# EAGLE schematic suitcase_main_board (EAGLE 8.2.0)
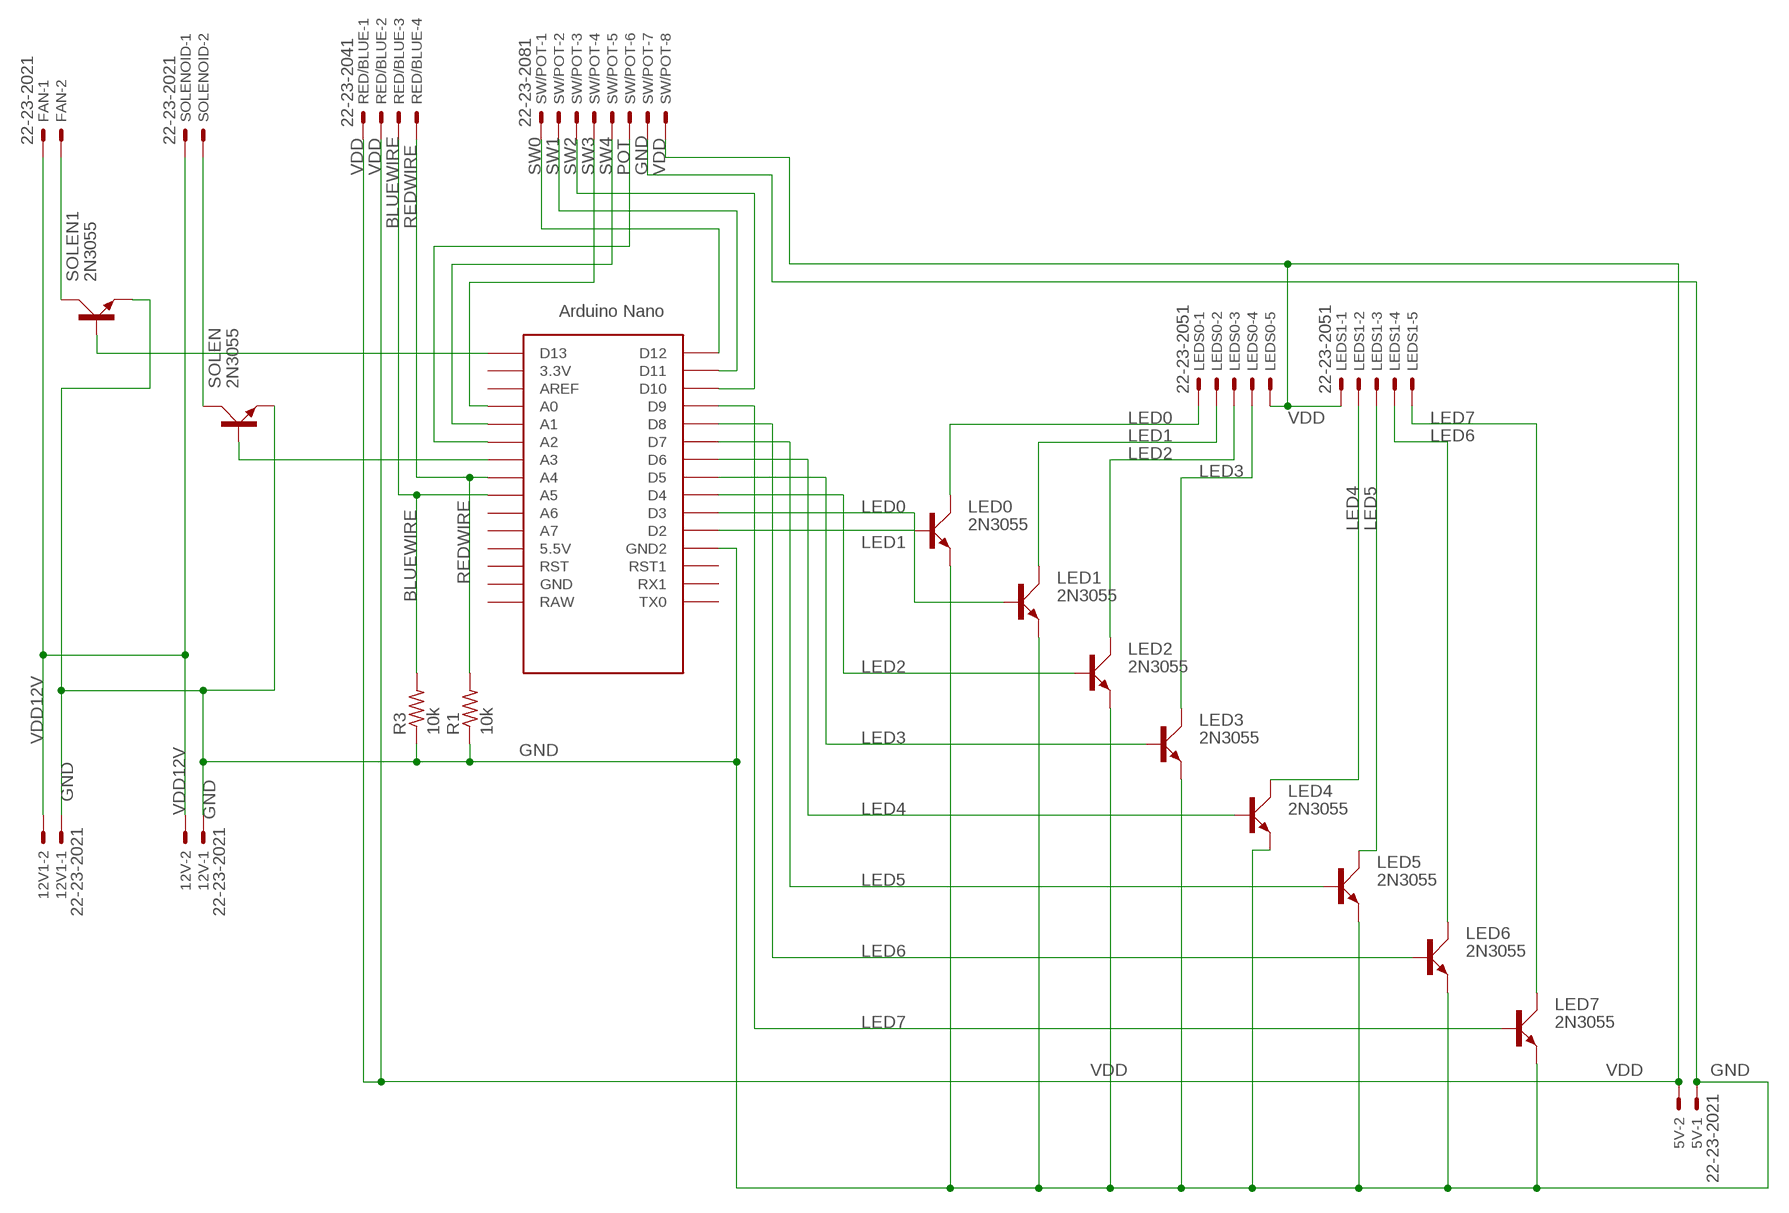
[diagram p0: schematic, sheet 1]

## Parts
5V  22-23-2021  [22-23-2021]
12V  22-23-2021  [22-23-2021]
12V1  22-23-2021  [22-23-2021]
FAN  22-23-2021  [22-23-2021]
LED0  2N3055  [TO3A]
LED1  2N3055  [TO3A]
LED2  2N3055  [TO3A]
LED3  2N3055  [TO3A]
LED4  2N3055  [TO3A]
LED5  2N3055  [TO3A]
LED6  2N3055  [TO3A]
LED7  2N3055  [TO3A]
LEDS0  22-23-2051  [22-23-2051]
LEDS1  22-23-2051  [22-23-2051]
R1  10k  R-US_0207/12  [0207/12]
R3  10k  R-US_0207/12  [0207/12]
RED/BLUE  22-23-2041  [22-23-2041]
SOLEN  2N3055  [TO3A]
SOLEN1  2N3055  [TO3A]
SOLENOID  22-23-2021  [22-23-2021]
SW/POT  22-23-2081  [22-23-2081]
U$1  NANO  [NANO]

## Nets
BLUEWIRE: R3.2 RED/BLUE.3 U$1.A5
GND: 5V.1 12V1.1 12V.1 LED0.E LED1.E LED2.E LED3.E LED4.E LED5.E LED6.E LED7.E R1.1 R3.1 SOLEN1.E SOLEN.E SW/POT.7 U$1.GND1(GND2)
LED0: LED0.C LED0.C1(C) LED1.B LEDS0.1 U$1.D3
LED1: LED0.B LED1.C LED1.C1(C) LEDS0.2 U$1.D2
LED2: LED2.B LED2.C LED2.C1(C) LEDS0.3 U$1.D4
LED3: LED3.B LED3.C LED3.C1(C) LEDS0.4 U$1.D5
LED4: LED4.B LED4.C LED4.C1(C) LEDS1.2 U$1.D6
LED5: LED5.B LED5.C LED5.C1(C) LEDS1.3 U$1.D7
LED6: LED6.B LED6.C LED6.C1(C) LEDS1.4 U$1.D8
LED7: LED7.B LED7.C LED7.C1(C) LEDS1.5 U$1.D9
N$1: FAN.2 SOLEN1.C SOLEN1.C1(C)
N$2: SOLEN1.B U$1.D13
N$4: SOLEN.C SOLEN.C1(C) SOLENOID.2
N$5: SOLEN.B U$1.A3
POT: SW/POT.6 U$1.A2
REDWIRE: R1.2 RED/BLUE.4 U$1.A4
SW0: SW/POT.1 U$1.D12
SW1: SW/POT.2 U$1.D11
SW2: SW/POT.3 U$1.D10
SW3: SW/POT.4 U$1.A0
SW4: SW/POT.5 U$1.A1
VDD: 5V.2 LEDS0.5 LEDS1.1 RED/BLUE.1 RED/BLUE.2 SW/POT.8
VDD12V: 12V1.2 12V.2 FAN.1 SOLENOID.1
Unconnected: U$1.3.3V U$1.5V(5.5V) U$1.A6 U$1.A7 U$1.AREF U$1.GND U$1.ICSP1 U$1.ICSP2 U$1.ICSP3 U$1.ICSP4 U$1.ICSP5 U$1.ICSP6 U$1.RAW U$1.RST U$1.RST1 U$1.RX1 U$1.TX0

## Library data of the parts
5V 12V 12V1 FAN SOLENOID = con-molex:22-23-2021: .100" (2.54mm) Center Header - 2 Pin; MF: MOLEX; MPN: 22-23-2021; OC_FARNELL: 1462926; OC_NEWARK: 25C3832
LED0 LED1-LED7 SOLEN SOLEN1 = transistor-power:2N3055: NPN TRANSISTOR
LEDS0 LEDS1 = con-molex:22-23-2051: .100" (2.54mm) Center Header - 5 Pin; MF: MOLEX; MPN: 22-23-2051; OC_FARNELL: 1462952; OC_NEWARK: 38C9178
R1 R3 = resistor:R-US_: RESISTOR, American symbol
RED/BLUE = con-molex:22-23-2041: .100" (2.54mm) Center Header - 4 Pin; MF: MOLEX; MPN: 22-23-2041; OC_FARNELL: 1462920; OC_NEWARK: 38C0355
SW/POT = con-molex:22-23-2081: .100" (2.54mm) Center Header - 8 Pin; MF: MOLEX; MPN: 22-23-2081; OC_FARNELL: 1756826; OC_NEWARK: 01C7592
U$1 = Arduino-clone:NANO: Arduino Nano